# Altium schematic sheet Server Power.schdoc
size 476 x 195 mm
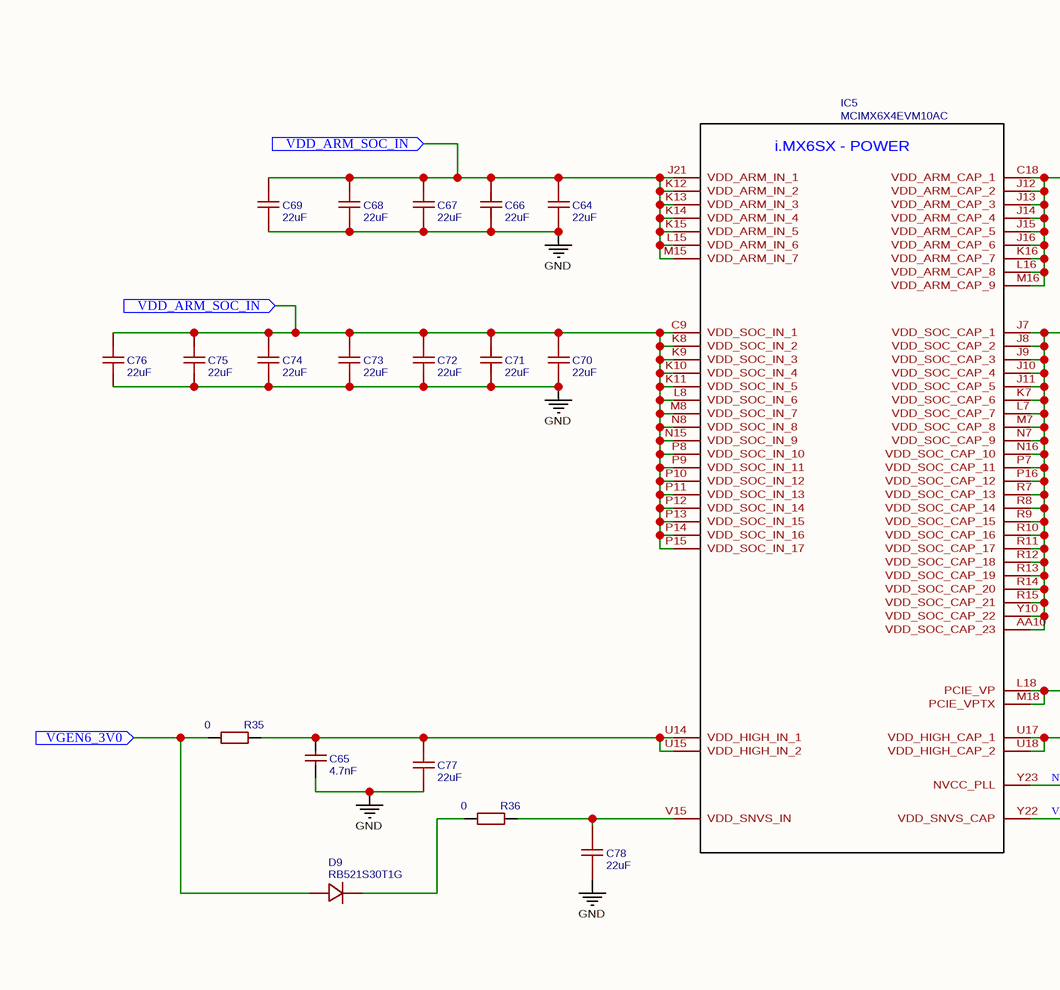
[diagram p0: Server Power.schdoc, left]
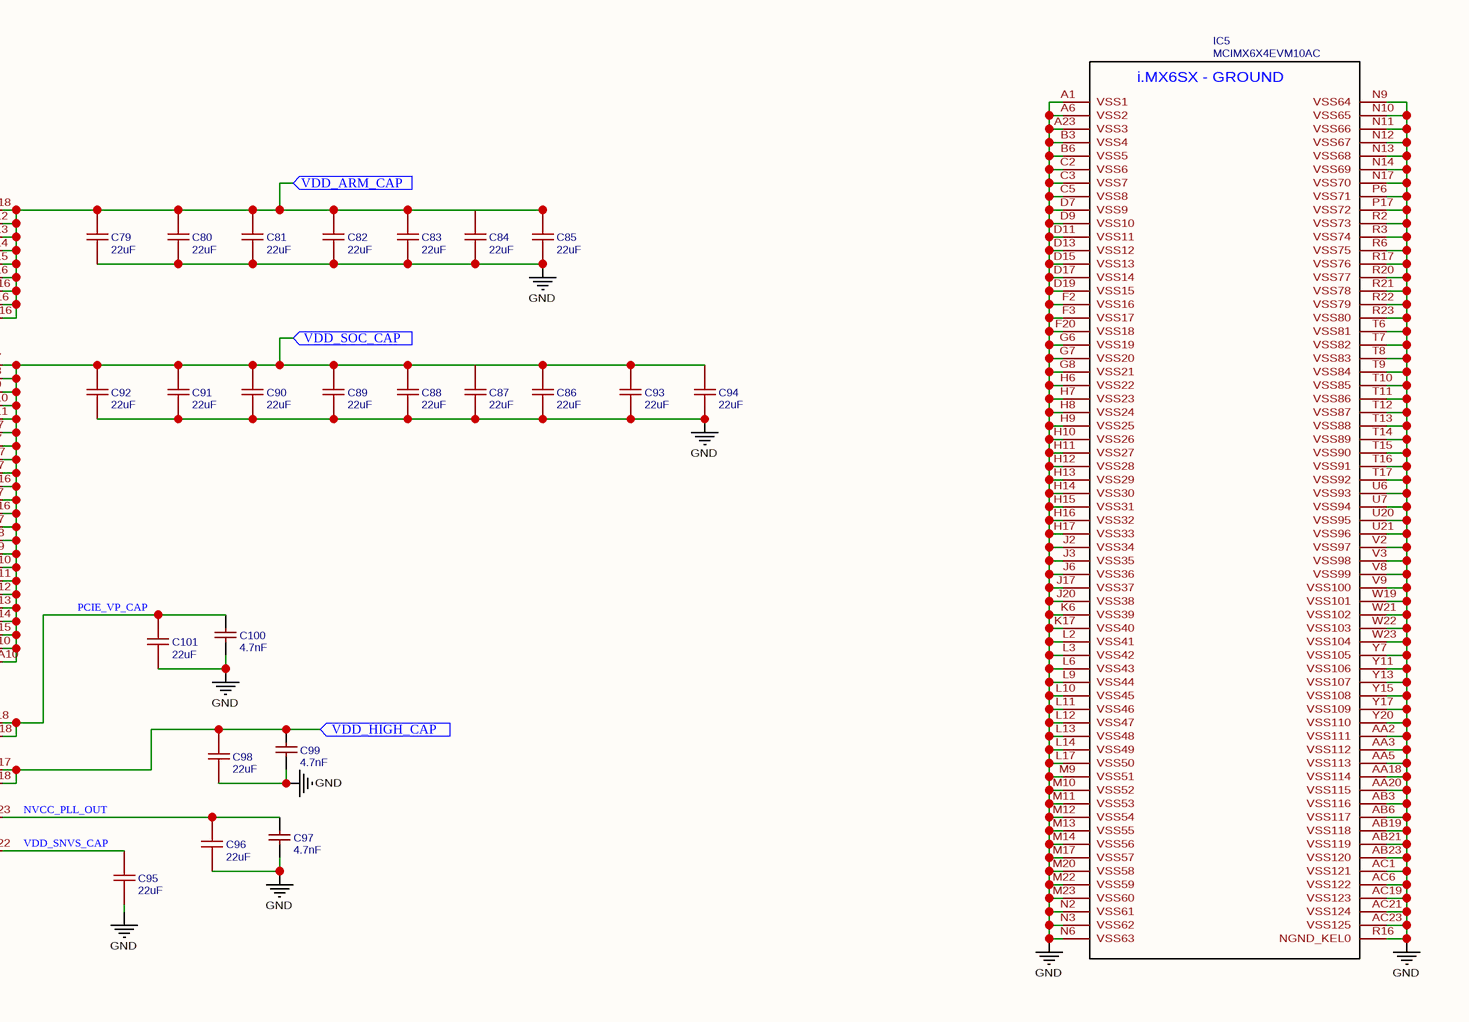
[diagram p1: Server Power.schdoc, right]

## Parts
(Parts that share a designator on the sheet are numbered #1, #2 ... from top to bottom, then left to right.)
C64  22uF  [C0603]
C65  4.7nF  [C0805]
C66  22uF  [C0603]
C67  22uF  [C0603]
C68  22uF  [C0603]
C69  22uF  [C0603]
C70  22uF  [C0603]
C71  22uF  [C0603]
C72  22uF  [C0603]
C73  22uF  [C0603]
C74  22uF  [C0603]
C75  22uF  [C0603]
C76  22uF  [C0603]
C77  22uF  [C0603]
C78  22uF  [C0603]
C79  22uF  [C0603]
C80  22uF  [C0603]
C81  22uF  [C0603]
C82  22uF  [C0603]
C83  22uF  [C0603]
C84  22uF  [C0603]
C85  22uF  [C0603]
C86  22uF  [C0603]
C87  22uF  [C0603]
C88  22uF  [C0603]
C89  22uF  [C0603]
C90  22uF  [C0603]
C91  22uF  [C0603]
C92  22uF  [C0603]
C93  22uF  [C0603]
C94  22uF  [C0603]
C95  22uF  [C0603]
C96  22uF  [C0603]
C97  4.7nF  [C0805]
C98  22uF  [C0603]
C99  4.7nF  [C0805]
C100  4.7nF  [C0805]
C101  22uF  [C0603]
D9  RB521S30T1G  [SOD-523_L1.2-W0.8-LS1.6-RD]
IC5#1  MCIMX6X4EVM10AC  [BGA529C80P23X23_1900X1900X152]
IC5#2  MCIMX6X4EVM10AC  [BGA529C80P23X23_1900X1900X152]
R35  0  [R0402]
R36  0  [R0402]

## Ports
VDD_ARM_CAP (in), VDD_ARM_SOC_IN (in), VDD_HIGH_CAP (in), VDD_SOC_CAP (in), VGEN6_3V0 (in)

## Nets
GND: C64.1 C65.1 C66.1 C67.1 C68.1 C69.1 C70.1 C71.1 C72.1 C73.1 C74.1 C75.1 C76.1 C77.1 C78.1 C79.1 C80.1 C81.1 C82.1 C83.1 C84.1 C85.1 C86.1 C87.1 C88.1 C89.1 C90.1 C91.1 C92.1 C93.1 C94.1 C95.1 C96.1 C97.1 C98.1 C99.1 C100.1 C101.1 IC5#2.A1(VSS1) IC5#2.A6(VSS2) IC5#2.A23(VSS3) IC5#2.AA2(VSS111) IC5#2.AA3(VSS112) IC5#2.AA5(VSS113) IC5#2.AA18(VSS114) IC5#2.AA20(VSS115) IC5#2.AB3(VSS116) IC5#2.AB6(VSS117) IC5#2.AB19(VSS118) IC5#2.AB21(VSS119) IC5#2.AB23(VSS120) IC5#2.AC1(VSS121) IC5#2.AC6(VSS122) IC5#2.AC19(VSS123) IC5#2.AC21(VSS124) IC5#2.AC23(VSS125) IC5#2.B3(VSS4) IC5#2.B6(VSS5) IC5#2.C2(VSS6) IC5#2.C3(VSS7) IC5#2.C5(VSS8) IC5#2.D7(VSS9) IC5#2.D9(VSS10) IC5#2.D11(VSS11) IC5#2.D13(VSS12) IC5#2.D15(VSS13) IC5#2.D17(VSS14) IC5#2.D19(VSS15) IC5#2.F2(VSS16) IC5#2.F3(VSS17) IC5#2.F20(VSS18) IC5#2.G6(VSS19) IC5#2.G7(VSS20) IC5#2.G8(VSS21) IC5#2.H6(VSS22) IC5#2.H7(VSS23) IC5#2.H8(VSS24) IC5#2.H9(VSS25) IC5#2.H10(VSS26) IC5#2.H11(VSS27) IC5#2.H12(VSS28) IC5#2.H13(VSS29) IC5#2.H14(VSS30) IC5#2.H15(VSS31) IC5#2.H16(VSS32) IC5#2.H17(VSS33) IC5#2.J2(VSS34) IC5#2.J3(VSS35) IC5#2.J6(VSS36) IC5#2.J17(VSS37) IC5#2.J20(VSS38) IC5#2.K6(VSS39) IC5#2.K17(VSS40) IC5#2.L2(VSS41) IC5#2.L3(VSS42) IC5#2.L6(VSS43) IC5#2.L9(VSS44) IC5#2.L10(VSS45) IC5#2.L11(VSS46) IC5#2.L12(VSS47) IC5#2.L13(VSS48) IC5#2.L14(VSS49) IC5#2.L17(VSS50) IC5#2.M9(VSS51) IC5#2.M10(VSS52) IC5#2.M11(VSS53) IC5#2.M12(VSS54) IC5#2.M13(VSS55) IC5#2.M14(VSS56) IC5#2.M17(VSS57) IC5#2.M20(VSS58) IC5#2.M22(VSS59) IC5#2.M23(VSS60) IC5#2.N2(VSS61) IC5#2.N3(VSS62) IC5#2.N6(VSS63) IC5#2.N9(VSS64) IC5#2.N10(VSS65) IC5#2.N11(VSS66) IC5#2.N12(VSS67) IC5#2.N13(VSS68) IC5#2.N14(VSS69) IC5#2.N17(VSS70) IC5#2.P6(VSS71) IC5#2.P17(VSS72) IC5#2.R2(VSS73) IC5#2.R3(VSS74) IC5#2.R6(VSS75) IC5#2.R16(NGND_KEL0) IC5#2.R17(VSS76) IC5#2.R20(VSS77) IC5#2.R21(VSS78) IC5#2.R22(VSS79) IC5#2.R23(VSS80) IC5#2.T6(VSS81) IC5#2.T7(VSS82) IC5#2.T8(VSS83) IC5#2.T9(VSS84) IC5#2.T10(VSS85) IC5#2.T11(VSS86) IC5#2.T12(VSS87) IC5#2.T13(VSS88) IC5#2.T14(VSS89) IC5#2.T15(VSS90) IC5#2.T16(VSS91) IC5#2.T17(VSS92) IC5#2.U6(VSS93) IC5#2.U7(VSS94) IC5#2.U20(VSS95) IC5#2.U21(VSS96) IC5#2.V2(VSS97) IC5#2.V3(VSS98) IC5#2.V8(VSS99) IC5#2.V9(VSS100) IC5#2.W19(VSS101) IC5#2.W21(VSS102) IC5#2.W22(VSS103) IC5#2.W23(VSS104) IC5#2.Y7(VSS105) IC5#2.Y11(VSS106) IC5#2.Y13(VSS107) IC5#2.Y15(VSS108) IC5#2.Y17(VSS109) IC5#2.Y20(VSS110)
NVCC_PLL_OUT: C96.2 C97.2 IC5#1.Y23(NVCC_PLL)
PCIE_VP_CAP: C100.2 C101.2 IC5#1.L18(PCIE_VP) IC5#1.M18(PCIE_VPTX)
VDD_ARM_CAP: C79.2 C80.2 C81.2 C82.2 C83.2 C84.2 C85.2 IC5#1.C18(VDD_ARM_CAP_1) IC5#1.J12(VDD_ARM_CAP_2) IC5#1.J13(VDD_ARM_CAP_3) IC5#1.J14(VDD_ARM_CAP_4) IC5#1.J15(VDD_ARM_CAP_5) IC5#1.J16(VDD_ARM_CAP_6) IC5#1.K16(VDD_ARM_CAP_7) IC5#1.L16(VDD_ARM_CAP_8) IC5#1.M16(VDD_ARM_CAP_9) ; port VDD_ARM_CAP
VDD_ARM_SOC_IN: C64.2 C66.2 C67.2 C68.2 C69.2 C70.2 C71.2 C72.2 C73.2 C74.2 C75.2 C76.2 IC5#1.C9(VDD_SOC_IN_1) IC5#1.J21(VDD_ARM_IN_1) IC5#1.K8(VDD_SOC_IN_2) IC5#1.K9(VDD_SOC_IN_3) IC5#1.K10(VDD_SOC_IN_4) IC5#1.K11(VDD_SOC_IN_5) IC5#1.K12(VDD_ARM_IN_2) IC5#1.K13(VDD_ARM_IN_3) IC5#1.K14(VDD_ARM_IN_4) IC5#1.K15(VDD_ARM_IN_5) IC5#1.L8(VDD_SOC_IN_6) IC5#1.L15(VDD_ARM_IN_6) IC5#1.M8(VDD_SOC_IN_7) IC5#1.M15(VDD_ARM_IN_7) IC5#1.N8(VDD_SOC_IN_8) IC5#1.N15(VDD_SOC_IN_9) IC5#1.P8(VDD_SOC_IN_10) IC5#1.P9(VDD_SOC_IN_11) IC5#1.P10(VDD_SOC_IN_12) IC5#1.P11(VDD_SOC_IN_13) IC5#1.P12(VDD_SOC_IN_14) IC5#1.P13(VDD_SOC_IN_15) IC5#1.P14(VDD_SOC_IN_16) IC5#1.P15(VDD_SOC_IN_17) ; port VDD_ARM_SOC_IN
VDD_HIGH_CAP: C98.2 C99.2 IC5#1.U17(VDD_HIGH_CAP_1) IC5#1.U18(VDD_HIGH_CAP_2) ; port VDD_HIGH_CAP
VDD_SNVS_CAP: C95.2 IC5#1.Y22(VDD_SNVS_CAP)
VDD_SOC_CAP: C86.2 C87.2 C88.2 C89.2 C90.2 C91.2 C92.2 C93.2 C94.2 IC5#1.AA10(VDD_SOC_CAP_23) IC5#1.J7(VDD_SOC_CAP_1) IC5#1.J8(VDD_SOC_CAP_2) IC5#1.J9(VDD_SOC_CAP_3) IC5#1.J10(VDD_SOC_CAP_4) IC5#1.J11(VDD_SOC_CAP_5) IC5#1.K7(VDD_SOC_CAP_6) IC5#1.L7(VDD_SOC_CAP_7) IC5#1.M7(VDD_SOC_CAP_8) IC5#1.N7(VDD_SOC_CAP_9) IC5#1.N16(VDD_SOC_CAP_10) IC5#1.P7(VDD_SOC_CAP_11) IC5#1.P16(VDD_SOC_CAP_12) IC5#1.R7(VDD_SOC_CAP_13) IC5#1.R8(VDD_SOC_CAP_14) IC5#1.R9(VDD_SOC_CAP_15) IC5#1.R10(VDD_SOC_CAP_16) IC5#1.R11(VDD_SOC_CAP_17) IC5#1.R12(VDD_SOC_CAP_18) IC5#1.R13(VDD_SOC_CAP_19) IC5#1.R14(VDD_SOC_CAP_20) IC5#1.R15(VDD_SOC_CAP_21) IC5#1.Y10(VDD_SOC_CAP_22) ; port VDD_SOC_CAP
VGEN6_3V0: D9.2(A) R35.1 ; port VGEN6_3V0
NetC65_2: C65.2 C77.2 IC5#1.U14(VDD_HIGH_IN_1) IC5#1.U15(VDD_HIGH_IN_2) R35.2
NetC78_2: C78.2 IC5#1.V15(VDD_SNVS_IN) R36.2
NetD9_1: D9.1(C) R36.1

## Notes on the sheet
- (in symbol MCIMX6X4EVM10AC) i.MX6SX - POWER; i.MX6SX - GROUND

## Library data of the parts
C64 C66-C96 C98 C101 = 22uF: BOM_Manufacturer: SAMSUNG; BOM_Manufacturer Part: CL10A226MP8NUNE; nameAlias: Capacitance; SMT Type: Extend; BOM_Supplier: LCSC; BOM_Supplier Part: C86295; BOM_LCSC Assembly: Yes; spicePre: C; spiceSymbolName: CL10A226MP8NUNE
C65 C97 C99 C100 = 4.7nF: BOM_Manufacturer: FH; BOM_Manufacturer Part: 0805B472K500NT; nameAlias: Capacitance; SMT Type: Basic; BOM_Supplier: LCSC; BOM_LCSC Assembly: Yes; BOM_Supplier Part: C1744; spicePre: C; spiceSymbolName: 0805B472K500NT
D9 = RB521S30T1G: BOM_Manufacturer: ON Semicon; Contributor: LCSC; SMT Type: Extend; BOM_Supplier: LCSC; BOM_Supplier Part: C145179; BOM_Manufacturer Part: RB521S30T1G; BOM_LCSC Assembly: Yes; spicePre: D; spiceSymbolName: RB521S30T1G
IC5#1 IC5#2 = MCIMX6X4EVM10AC: subpart_no: 1; Contributor: Ke'Ondrae_Mell; spicePre: I; spiceSymbolName: MCIMX6X4EVM10AC
R35 R36 = 0: BOM_Manufacturer: KOA; BOM_Manufacturer Part: RK73Z1ETTP; nameAlias: Resistance (Ohms); BOM_Supplier: LCSC; BOM_Supplier Part: C131359; spicePre: R; spiceSymbolName: RK73Z1ETTP